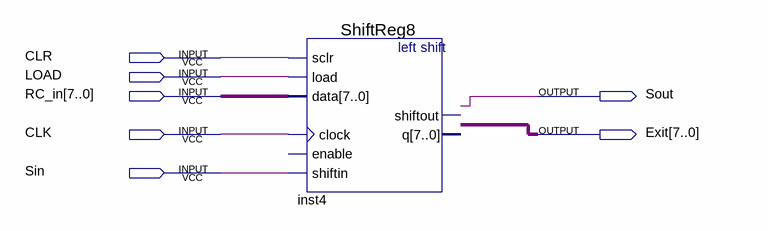
[diagram p0: schematic sheet]
// Quartus schematic TestReg.bdf as structural Verilog: 1 symbols, 7 pins
module TestReg (
  input  CLR,
  input  LOAD,
  input  [7:0] RC_in,
  input  CLK,
  input  Sin,
  output Sout,
  output [7:0] Exit
);

  ShiftReg8 inst4 (.sclr(CLR), .load(LOAD), .data(RC_in), .clock(CLK), .shiftin(Sin));  // open: enable, shiftout, q
endmodule
